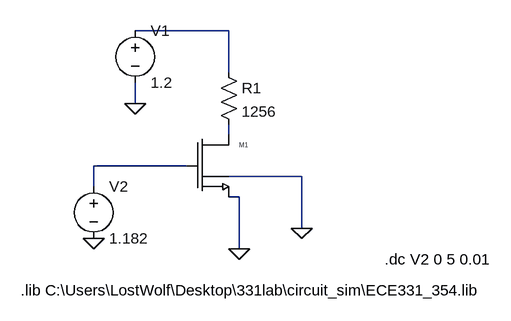
[diagram p0: schematic lab1_nmos 1.2V.asc]
lab1_nmos 1.2V.asc, the LTspice schematic file:
Version 4
SHEET 1 880 680
WIRE 176 -48 32 -48
WIRE 176 16 176 -48
WIRE 32 64 32 32
WIRE 176 112 176 96
WIRE 112 160 -32 160
WIRE 288 176 176 176
WIRE -32 192 -32 160
WIRE 192 208 176 208
WIRE 288 256 288 176
WIRE 192 288 192 208
FLAG 192 288 0
FLAG 32 64 0
FLAG 288 256 0
FLAG -32 272 0
SYMBOL ALD1101 112 112 R0
SYMATTR InstName M1
SYMATTR SpiceModel ""
SYMATTR SpiceLine ""
SYMATTR Value ALD1101
SYMATTR Value2 W=1.379e-3 L=1E-6
SYMBOL res 160 0 R0
SYMATTR InstName R1
SYMATTR Value 1256
SYMBOL voltage 32 -64 R0
WINDOW 123 0 0 Left 2
WINDOW 39 0 0 Left 2
SYMATTR InstName V1
SYMATTR Value 1.2
SYMBOL voltage -32 176 R0
WINDOW 123 0 0 Left 2
WINDOW 39 0 0 Left 2
SYMATTR InstName V2
SYMATTR Value 1.182
TEXT -144 352 Left 2 !.lib C:\\Users\\LostWolf\\Desktop\\331lab\\circuit_sim\\ECE331_354.lib
TEXT 416 304 Left 2 !.dc V2 0 5 0.01

The netlist it stands for:
* lab1_nmos 1.2V.asc
M1 N002 N003 0 0 ALD1101 W=1.379e-3 L=1E-6
R1 N001 N002 1256
V1 N001 0 1.2
V2 N003 0 1.182
.model NMOS NMOS
.model PMOS PMOS
.lib standard.mos
.lib C:\Users\LostWolf\Desktop\331lab\circuit_sim\ECE331_354.lib
.dc V2 0 5 0.01
.backanno
.end